# Altium project eRTM15_Baikal.PrjPCB (part 2 of 4)

## Sheet Reference_distribution.SchDoc: =ProjectName
size 420 x 297 mm; Author: SBH; CompanyName: WUT; DrawnBy: SBH; Organization: ISE-WUT; Address1: Warsaw Univeristy of Technology; Address2: Nowowiejska 15/19; DocumentNumber: 8; Revision: -; SheetNumber: 8; SheetTotal: 12; EDA_Number: ARTIQ; Projet: eRTM15 Baikal; ModifiedBy: -; CreateDate: XX/XX/XXXX; CheckedDate: -; Title2: Reference_distribution.SchDoc; DivGrp: ISE; Designer: SBH; ModifiedDate: -; ProjectName: eRTM15 Baikal
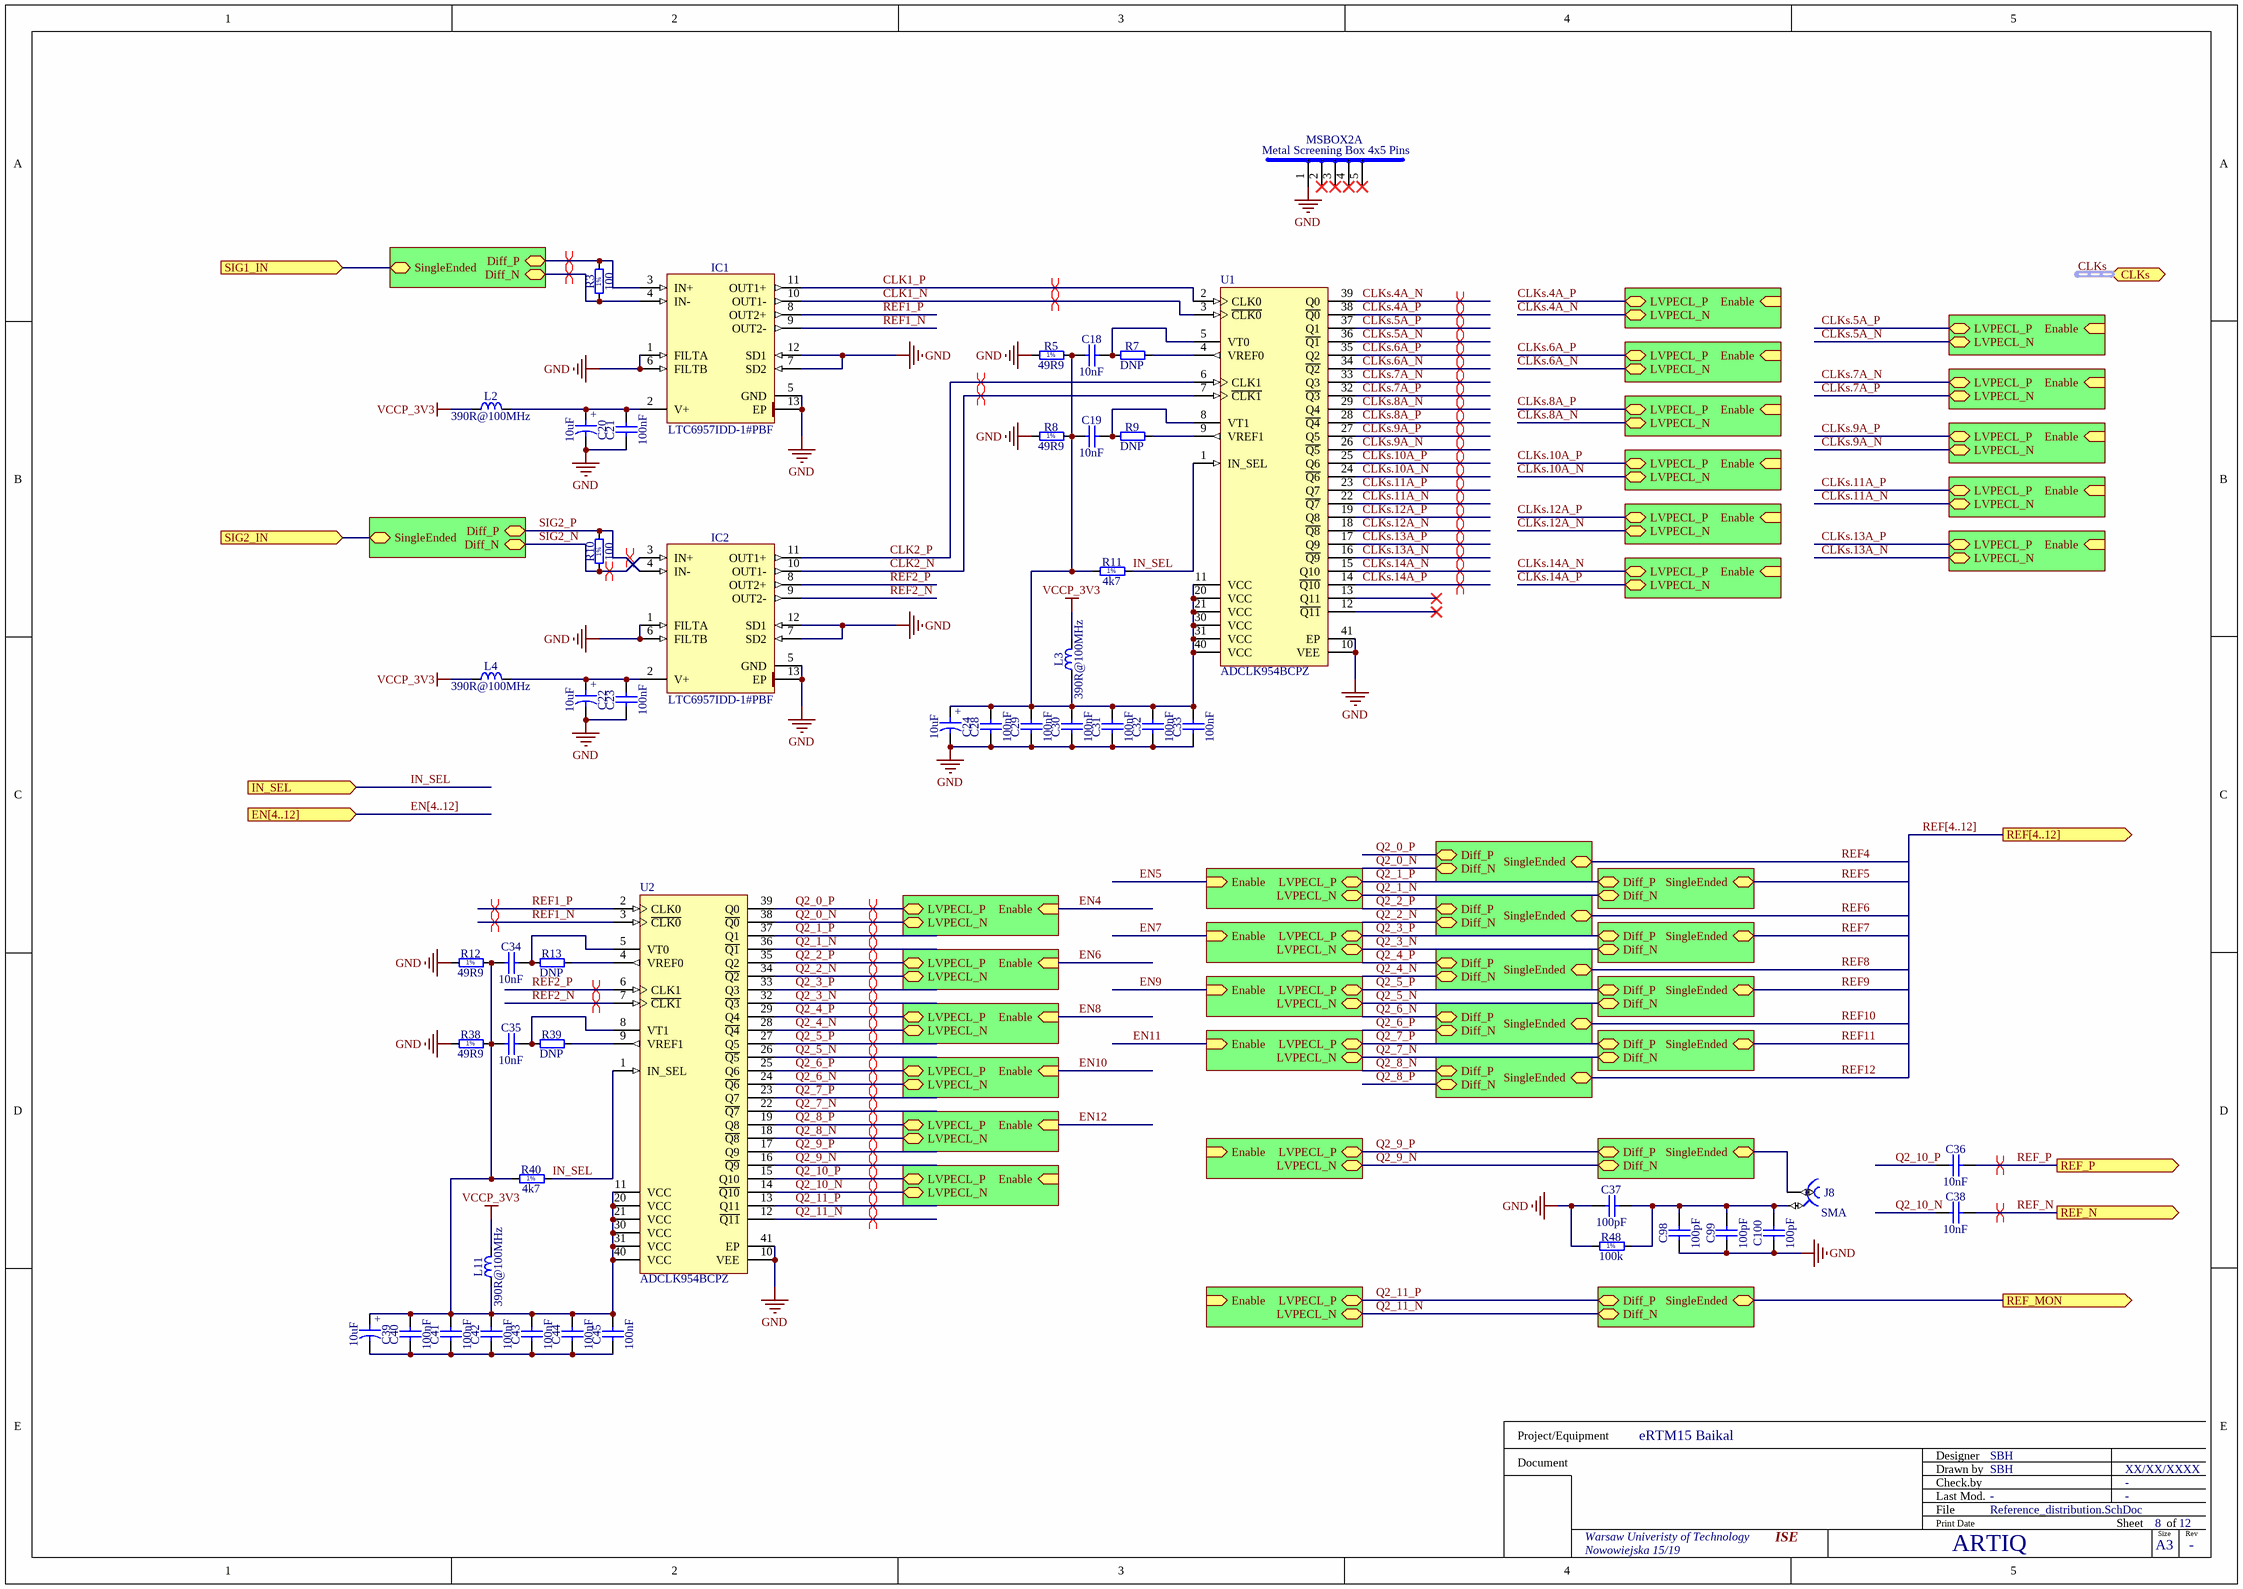
[diagram p5: Reference_distribution.SchDoc]

### Parts
C18  10nF  [CAPC1005X55N]
C19  10nF  [CAPC1005X55N]
C20  10uF  [CAPMP3216X180N]
C21  100nF  [CAPC1005X55N]
C22  10uF  [CAPMP3216X180N]
C23  100nF  [CAPC1005X55N]
C24  10uF  [CAPMP3216X180N]
C28  100nF  [CAPC1005X55N]
C29  100nF  [CAPC1005X55N]
C30  100nF  [CAPC1005X55N]
C31  100nF  [CAPC1005X55N]
C32  100nF  [CAPC1005X55N]
C33  100nF  [CAPC1005X55N]
C34  10nF  [CAPC1005X55N]
C35  10nF  [CAPC1005X55N]
C36  10nF  [CAPC1005X55N]
C37  100pF  [CAPC1005X55N]
C38  10nF  [CAPC1005X55N]
C39  10uF  [CAPMP3216X180N]
C40  100nF  [CAPC1005X55N]
C41  100nF  [CAPC1005X55N]
C42  100nF  [CAPC1005X55N]
C43  100nF  [CAPC1005X55N]
C44  100nF  [CAPC1005X55N]
C45  100nF  [CAPC1005X55N]
C98  100pF  [CAPC1005X55N]
C99  100pF  [CAPC1005X55N]
C100  100pF  [CAPC1005X55N]
IC1  LTC6957IDD-1#PBF  [SON45P300X300X80-13N-R175X248]
IC2  LTC6957IDD-1#PBF  [SON45P300X300X80-13N-R175X248]
J8  SMA  [HUBER-SUHNER_82_SMA-50-0-41/133_NE]
L2  390R@100MHz  [INDC1608X95N]
L3  390R@100MHz  [INDC1608X95N]
L4  390R@100MHz  [INDC1608X95N]
L11  390R@100MHz  [INDC1608X95N]
MSBOX2  Metal Screening Box 4x5 Pins  [MSBOX_WURTH_36103305]  (part A of 4)
R3  100  [RESC1005X40N]
R5  49R9  [RESC1005X40N]
R7  DNP  [RESC1005X40N]
R8  49R9  [RESC1005X40N]
R9  DNP  [RESC1005X40N]
R10  100  [RESC1005X40N]
R11  4k7  [RESC1005X40N]
R12  49R9  [RESC1005X40N]
R13  DNP  [RESC1005X40N]
R38  49R9  [RESC1005X40N]
R39  DNP  [RESC1005X40N]
R40  4k7  [RESC1005X40N]
R48  100k  [RESC1005X40N]
U1  ADCLK954BCPZ  [ADI-CP-40-8_M]
U2  ADCLK954BCPZ  [ADI-CP-40-8_M]

### Sub-sheets
U_Diff2SE = Diff2SE.SchDoc: Diff_P, Diff_N, SingleEnded
U_Diff2SE = Diff2SE.SchDoc: Diff_P, Diff_N, SingleEnded
U_Diff2SE = Diff2SE.SchDoc: Diff_P, Diff_N, SingleEnded
U_Diff2SE = Diff2SE.SchDoc: Diff_P, Diff_N, SingleEnded
U_Diff2SE = Diff2SE.SchDoc: Diff_P, Diff_N, SingleEnded
U_Diff2SE = Diff2SE.SchDoc: Diff_P, Diff_N, SingleEnded
U_Diff2SE = Diff2SE.SchDoc: Diff_P, Diff_N, SingleEnded
U_Diff2SE = Diff2SE.SchDoc: Diff_P, Diff_N, SingleEnded
U_Diff2SE = Diff2SE.SchDoc: Diff_P, Diff_N, SingleEnded
U_Diff2SE = Diff2SE.SchDoc: Diff_P, Diff_N, SingleEnded
U_Diff2SE = Diff2SE.SchDoc: Diff_P, Diff_N, SingleEnded
U_Diff2SE = Diff2SE.SchDoc: Diff_P, Diff_N, SingleEnded
U_Diff2SE = Diff2SE.SchDoc: Diff_P, Diff_N, SingleEnded
U_LvpeclTermWithCtrl = LvpeclTermWithCtrl.SchDoc: LVPECL_P (bidir), LVPECL_N (bidir), Enable (in)
U_LvpeclTermWithCtrl = LvpeclTermWithCtrl.SchDoc: LVPECL_P (bidir), LVPECL_N (bidir), Enable (in)
U_LvpeclTermWithCtrl = LvpeclTermWithCtrl.SchDoc: LVPECL_P (bidir), LVPECL_N (bidir), Enable (in)
U_LvpeclTermWithCtrl = LvpeclTermWithCtrl.SchDoc: LVPECL_P (bidir), LVPECL_N (bidir), Enable (in)
U_LvpeclTermWithCtrl = LvpeclTermWithCtrl.SchDoc: LVPECL_P (bidir), LVPECL_N (bidir), Enable (in)
U_LvpeclTermWithCtrl = LvpeclTermWithCtrl.SchDoc: LVPECL_P (bidir), LVPECL_N (bidir), Enable (in)
U_LvpeclTermWithCtrl = LvpeclTermWithCtrl.SchDoc: LVPECL_P (bidir), LVPECL_N (bidir), Enable (in)
U_LvpeclTermWithCtrl = LvpeclTermWithCtrl.SchDoc: LVPECL_P (bidir), LVPECL_N (bidir), Enable (in)
U_LvpeclTermWithCtrl = LvpeclTermWithCtrl.SchDoc: LVPECL_P (bidir), LVPECL_N (bidir), Enable (in)
U_LvpeclTermWithCtrl = LvpeclTermWithCtrl.SchDoc: LVPECL_P (bidir), LVPECL_N (bidir), Enable (in)
U_LvpeclTermWithCtrl = LvpeclTermWithCtrl.SchDoc: LVPECL_P (bidir), LVPECL_N (bidir), Enable (in)
U_LvpeclTermWithCtrl = LvpeclTermWithCtrl.SchDoc: LVPECL_P (bidir), LVPECL_N (bidir), Enable (in)
U_LvpeclTermWithCtrl = LvpeclTermWithCtrl.SchDoc: LVPECL_P (bidir), LVPECL_N (bidir), Enable (in)
U_LvpeclTermWithCtrl = LvpeclTermWithCtrl.SchDoc: LVPECL_P (bidir), LVPECL_N (bidir), Enable (in)
U_LvpeclTermWithCtrl = LvpeclTermWithCtrl.SchDoc: LVPECL_P (bidir), LVPECL_N (bidir), Enable (in)
U_LvpeclTermWithCtrl = LvpeclTermWithCtrl.SchDoc: LVPECL_P (bidir), LVPECL_N (bidir), Enable (in)
U_LvpeclTermWithCtrl = LvpeclTermWithCtrl.SchDoc: LVPECL_P (bidir), LVPECL_N (bidir), Enable (in)
U_LvpeclTermWithCtrl = LvpeclTermWithCtrl.SchDoc: LVPECL_P (bidir), LVPECL_N (bidir), Enable (in)
U_LvpeclTermWithCtrl = LvpeclTermWithCtrl.SchDoc: LVPECL_P (bidir), LVPECL_N (bidir), Enable (in)
U_LvpeclTermWithCtrl = LvpeclTermWithCtrl.SchDoc: LVPECL_P (bidir), LVPECL_N (bidir), Enable (in)
U_LvpeclTermWithCtrl = LvpeclTermWithCtrl.SchDoc: LVPECL_P (bidir), LVPECL_N (bidir), Enable (in)
U_LvpeclTermWithCtrl = LvpeclTermWithCtrl.SchDoc: LVPECL_P (bidir), LVPECL_N (bidir), Enable (in)
U_LvpeclTermWithCtrl = LvpeclTermWithCtrl.SchDoc: LVPECL_P (bidir), LVPECL_N (bidir), Enable (in)

### Ports
CLKs (harness CLKs), EN[4..12] (in), IN_SEL (in), REF[4..12] (out), REF_MON (out), REF_N (out), REF_P (out), SIG1_IN (in), SIG2_IN (in)

### Nets
GND: C20.2 C21.1 C22.2 C23.1 C24.2 C28.1 C29.1 C30.1 C31.1 C32.1 C33.1 C37.2 C98.2 C99.2 C100.2 IC1.1(FILTA) IC1.5(GND) IC1.6(FILTB) IC1.7(SD2) IC1.12(SD1) IC1.13(EP) IC2.1(FILTA) IC2.5(GND) IC2.6(FILTB) IC2.7(SD2) IC2.12(SD1) IC2.13(EP) MSBOX2.1 R5.1 R8.1 R12.1 R38.1 R48.1 U1.10(VEE) U1.41(EP) U2.10(VEE) U2.41(EP)
VCCP_3V3: L2.1 L3.2 L4.1 L11.2
CLK1_N: IC1.10(OUT1-) U1.3(~{CLK0})
CLK1_P: IC1.11(OUT1+) U1.2(CLK0)
CLK2_N: IC2.10(OUT1-) U1.7(~{CLK1})
CLK2_P: IC2.11(OUT1+) U1.6(CLK1)
CLKs.4A_N: U1.39(Q0) ; sheet U_LvpeclTermWithCtrl/LVPECL_N
CLKs.4A_P: U1.38(~{Q0}) ; sheet U_LvpeclTermWithCtrl/LVPECL_P
CLKs.5A_N: U1.36(~{Q1}) ; sheet U_LvpeclTermWithCtrl/LVPECL_N
CLKs.5A_P: U1.37(Q1) ; sheet U_LvpeclTermWithCtrl/LVPECL_P
CLKs.6A_N: U1.34(~{Q2}) ; sheet U_LvpeclTermWithCtrl/LVPECL_N
CLKs.6A_P: U1.35(Q2) ; sheet U_LvpeclTermWithCtrl/LVPECL_P
CLKs.7A_N: U1.33(Q3) ; sheet U_LvpeclTermWithCtrl/LVPECL_P
CLKs.7A_P: U1.32(~{Q3}) ; sheet U_LvpeclTermWithCtrl/LVPECL_N
CLKs.8A_N: U1.29(Q4) ; sheet U_LvpeclTermWithCtrl/LVPECL_N
CLKs.8A_P: U1.28(~{Q4}) ; sheet U_LvpeclTermWithCtrl/LVPECL_P
CLKs.9A_N: U1.26(~{Q5}) ; sheet U_LvpeclTermWithCtrl/LVPECL_N
CLKs.9A_P: U1.27(Q5) ; sheet U_LvpeclTermWithCtrl/LVPECL_P
CLKs.10A_N: U1.24(~{Q6}) ; sheet U_LvpeclTermWithCtrl/LVPECL_N
CLKs.10A_P: U1.25(Q6) ; sheet U_LvpeclTermWithCtrl/LVPECL_P
CLKs.11A_N: U1.22(~{Q7}) ; sheet U_LvpeclTermWithCtrl/LVPECL_N
CLKs.11A_P: U1.23(Q7) ; sheet U_LvpeclTermWithCtrl/LVPECL_P
CLKs.12A_N: U1.18(~{Q8}) ; sheet U_LvpeclTermWithCtrl/LVPECL_N
CLKs.12A_P: U1.19(Q8) ; sheet U_LvpeclTermWithCtrl/LVPECL_P
CLKs.13A_N: U1.16(~{Q9}) ; sheet U_LvpeclTermWithCtrl/LVPECL_N
CLKs.13A_P: U1.17(Q9) ; sheet U_LvpeclTermWithCtrl/LVPECL_P
CLKs.14A_N: U1.15(Q10) ; sheet U_LvpeclTermWithCtrl/LVPECL_P
CLKs.14A_P: U1.14(~{Q10}) ; sheet U_LvpeclTermWithCtrl/LVPECL_N
Diff_N: IC1.4(IN-) R3.1 ; sheet U_Diff2SE/Diff_N
Diff_P: IC1.3(IN+) R3.2 ; sheet U_Diff2SE/Diff_P
IN_SEL: R11.2 R40.2 U1.1(IN_SEL) U2.1(IN_SEL) ; port IN_SEL
Osc_out: port SIG2_IN, sheet U_Diff2SE/SingleEnded
Q2_0_N: U2.38(~{Q0}) ; sheet U_Diff2SE/Diff_N, sheet U_LvpeclTermWithCtrl/LVPECL_N
Q2_0_P: U2.39(Q0) ; sheet U_Diff2SE/Diff_P, sheet U_LvpeclTermWithCtrl/LVPECL_P
Q2_1_N: U2.36(~{Q1}) ; sheet U_Diff2SE/Diff_N, sheet U_LvpeclTermWithCtrl/LVPECL_N
Q2_1_P: U2.37(Q1) ; sheet U_Diff2SE/Diff_P, sheet U_LvpeclTermWithCtrl/LVPECL_P
Q2_2_N: U2.34(~{Q2}) ; sheet U_Diff2SE/Diff_N, sheet U_LvpeclTermWithCtrl/LVPECL_N
Q2_2_P: U2.35(Q2) ; sheet U_Diff2SE/Diff_P, sheet U_LvpeclTermWithCtrl/LVPECL_P
Q2_3_N: U2.32(~{Q3}) ; sheet U_Diff2SE/Diff_N, sheet U_LvpeclTermWithCtrl/LVPECL_N
Q2_3_P: U2.33(Q3) ; sheet U_Diff2SE/Diff_P, sheet U_LvpeclTermWithCtrl/LVPECL_P
Q2_4_N: U2.28(~{Q4}) ; sheet U_Diff2SE/Diff_N, sheet U_LvpeclTermWithCtrl/LVPECL_N
Q2_4_P: U2.29(Q4) ; sheet U_Diff2SE/Diff_P, sheet U_LvpeclTermWithCtrl/LVPECL_P
Q2_5_N: U2.26(~{Q5}) ; sheet U_Diff2SE/Diff_N, sheet U_LvpeclTermWithCtrl/LVPECL_N
Q2_5_P: U2.27(Q5) ; sheet U_Diff2SE/Diff_P, sheet U_LvpeclTermWithCtrl/LVPECL_P
Q2_6_N: U2.24(~{Q6}) ; sheet U_Diff2SE/Diff_P, sheet U_LvpeclTermWithCtrl/LVPECL_N
Q2_6_P: U2.25(Q6) ; sheet U_Diff2SE/Diff_N, sheet U_LvpeclTermWithCtrl/LVPECL_P
Q2_7_N: U2.22(~{Q7}) ; sheet U_Diff2SE/Diff_N, sheet U_LvpeclTermWithCtrl/LVPECL_N
Q2_7_P: U2.23(Q7) ; sheet U_Diff2SE/Diff_P, sheet U_LvpeclTermWithCtrl/LVPECL_P
Q2_8_N: U2.18(~{Q8}) ; sheet U_Diff2SE/Diff_P, sheet U_LvpeclTermWithCtrl/LVPECL_N
Q2_8_P: U2.19(Q8) ; sheet U_Diff2SE/Diff_N, sheet U_LvpeclTermWithCtrl/LVPECL_P
Q2_9_N: U2.16(~{Q9}) ; sheet U_Diff2SE/Diff_N, sheet U_LvpeclTermWithCtrl/LVPECL_N
Q2_9_P: U2.17(Q9) ; sheet U_Diff2SE/Diff_P, sheet U_LvpeclTermWithCtrl/LVPECL_P
Q2_10_N: C38.1 U2.14(~{Q10}) ; sheet U_LvpeclTermWithCtrl/LVPECL_N
Q2_10_P: C36.1 U2.15(Q10) ; sheet U_LvpeclTermWithCtrl/LVPECL_P
Q2_11_N: U2.12(~{Q11}) ; sheet U_Diff2SE/Diff_N, sheet U_LvpeclTermWithCtrl/LVPECL_N
Q2_11_P: U2.13(Q11) ; sheet U_Diff2SE/Diff_P, sheet U_LvpeclTermWithCtrl/LVPECL_P
REF1_N: IC1.9(OUT2-) U2.3(~{CLK0})
REF1_P: IC1.8(OUT2+) U2.2(CLK0)
REF2_N: IC2.9(OUT2-) U2.7(~{CLK1})
REF2_P: IC2.8(OUT2+) U2.6(CLK1)
REF_IN: port SIG1_IN, sheet U_Diff2SE/SingleEnded
REF_N: C38.2 ; port REF_N  [project net REF_CLK_IN_N]
REF_OUT: port REF_MON, sheet U_Diff2SE/SingleEnded
REF_P: C36.2 ; port REF_P  [project net REF_CLK_IN_P]
SIG2_N: IC2.3(IN+) R10.1 ; sheet U_Diff2SE/Diff_N
SIG2_P: IC2.4(IN-) R10.2 ; sheet U_Diff2SE/Diff_P
SingleEnded: J8.1 ; sheet U_Diff2SE/SingleEnded
NetC18_1: C18.1 C19.1 C24.1 C28.2 C29.2 C30.2 C31.2 C32.2 C33.2 L3.1 R5.2 R8.2 R11.1 U1.11(VCC) U1.20(VCC) U1.21(VCC) U1.30(VCC) U1.31(VCC) U1.40(VCC)
NetC18_2: C18.2 R7.1 U1.5(VT0)
NetC19_2: C19.2 R9.1 U1.8(VT1)
NetC20_1: C20.1 C21.2 IC1.2(V+) L2.2
NetC22_1: C22.1 C23.2 IC2.2(V+) L4.2
NetC34_1: C34.1 C35.1 C39.1 C40.2 C41.2 C42.2 C43.2 C44.2 C45.2 L11.1 R12.2 R38.2 R40.1 U2.11(VCC) U2.20(VCC) U2.21(VCC) U2.30(VCC) U2.31(VCC) U2.40(VCC)
NetC34_2: C34.2 R13.1 U2.5(VT0)
NetC35_2: C35.2 R39.1 U2.8(VT1)
NetC37_1: C37.1 C98.1 C99.1 C100.1 J8.2 R48.2
NetC39_2: C39.2 C40.1 C41.1 C42.1 C43.1 C44.1 C45.1
NetR7_2: R7.2 U1.4(VREF0)
NetR9_2: R9.2 U1.9(VREF1)
NetR13_2: R13.2 U2.4(VREF0)
NetR39_2: R39.2 U2.9(VREF1)

Not connected (* = marked no-connect by the designer): MSBOX2 2* 3* 4* 5*; U1 12(~{Q11})* 13(Q11)*

### Buses and harness runs
bus EN[4..12] = port EN[4..12]
bus REF[4..12] = port REF[4..12]
harness CLKs = port CLKs

### Layout directives
differential pair: CLK1_N, CLK1_P, CLK2_N, CLK2_P, CLKs.4A_N, CLKs.4A_P, CLKs.5A_N, CLKs.5A_P, CLKs.6A_N, CLKs.6A_P, CLKs.7A_N, CLKs.7A_P, CLKs.8A_N, CLKs.8A_P, CLKs.9A_N, CLKs.9A_P, CLKs.10A_N, CLKs.10A_P, CLKs.11A_N, CLKs.11A_P, CLKs.12A_N, CLKs.12A_P, CLKs.13A_N, CLKs.13A_P, CLKs.14A_N, CLKs.14A_P, Diff_N, Diff_P, Q2_0_N, Q2_0_P, Q2_1_N, Q2_1_P, Q2_2_N, Q2_2_P, Q2_3_N, Q2_3_P, Q2_4_N, Q2_4_P, Q2_5_N, Q2_5_P, Q2_6_N, Q2_6_P, Q2_7_N, Q2_7_P, Q2_8_N, Q2_8_P, Q2_9_N, Q2_9_P, Q2_10_N, Q2_10_P, Q2_11_N, Q2_11_P, REF1_N, REF1_P, REF2_N, REF2_P, REF_CLK_IN_N, REF_CLK_IN_P, SIG2_N, SIG2_P

### Notes on the sheet
- Project/Equipment
- Document
- Designer
- Drawn by
- Check.by
- File
- Last Mod.
- Print Date
- Sheet
- Size
- A3
- of
- Rev
- (in symbol CTE3216-18_10UF_10V_10%_LESR1800) +
- (in symbol R0402_4K7_1%_0.0625W_100PPM) 1%
- (in symbol R0402_49R9_1%_0.0625W_100PPM) 1%
- (in symbol R0402_100R_1%_0.0625W_100PPM) 1%

### Library data of the parts
C18 C19 C34-C36 C38 = CC0402_10NF_16V_10%_X7R: Non-polarised capacitor; Part Description: SMD Multilayer Chip Ceramic Capacitor; Manufacturer: GENERIC; Manufacturer1 Part Number: 223878715636; Voltage: 16V; TC: X7R; Tolerance: ±10%; Part Number: CC0402_10NF_16V_10%_X7R; Component Kind: Standard; Component Type: Standard; Pin Count: 2; Value: 10nF; Status: Not Recommended; Manufacturer Part Number: CC0402_10NF_16V_10%_X7R; Case: 0402; Mounted: Yes; Socket: No; SMD: Yes; Sense: No; Manufacturer1 Example: PHYCOMP; Manufacturer1 ComponentHeight: 0.55mm; HelpURL: \\cern.ch\dfs\Applications\Altium\Datasheets\CC0402_X7R_PHYCOMP.pdf; Author: CERN DEM JLC; CreateDate: 2007-12-03; LatestRevisionDate: 2007-12-03
C20 C22 C24 C39 = CTE3216-18_10UF_10V_10%_LESR1800: Polarised capacitor; Part Description: Low ESR 1R8 Solid Tantalum Chip Capacitor; Manufacturer: GENERIC; Manufacturer1 Part Number: TPSA106K010R1800; Voltage: 10V; Tolerance: ±10%; Part Number: CTE3216-18_10UF_10V_10%_LESR1800; Component Kind: Standard; Component Type: Standard; Pin Count: 2; Value: 10uF; Status: Preferred; Manufacturer Part Number: CTE3216-18_10UF_10V_10%_LESR1800; Case: A; Mounted: Yes; Socket: No; SMD: Yes; Sense: No; Manufacturer1 Example: AVX; Manufacturer1 ComponentHeight: 1.8mm; HelpURL: \\cern.ch\dfs\Applications\Altium\Datasheets\CTE-LESR_AVX_TPS.pdf; Author: CERN DEM JLC; CreateDate: 2008-05-05; LatestRevisionDate: 2009-01-20
C21 C23 C28-C33 C40-C45 = CC0402_100NF_16V_10%_X7R: Non-polarised capacitor; Part Description: SMD Multilayer Chip Ceramic Capacitor; Manufacturer: GENERIC; Manufacturer1 Part Number: GRM155R71C104KA88D; Voltage: 16V; TC: X7R; Tolerance: ±10%; Part Number: CC0402_100NF_16V_10%_X7R; Component Kind: Standard; Component Type: Standard; Pin Count: 2; Value: 100nF; Status: Not Recommended; Manufacturer Part Number: CC0402_100NF_16V_10%_X7R; Case: 0402; Mounted: Yes; Socket: No; SMD: Yes; Sense: No; Manufacturer1 Example: MURATA; Manufacturer1 ComponentHeight: 0.55mm; HelpURL: \\cern.ch\dfs\Applications\Altium\Datasheets\CC0402_X7R_MURATA_GRM.pdf; Author: CERN DEM JLC; CreateDate: 2013-12-05; LatestRevisionDate: 2007-12-03
C37 C98-C100 = CC0402_100PF_50V_5%_C0G: Non-polarised capacitor; Part Description: SMD Multilayer Chip Ceramic Capacitor; Manufacturer: GENERIC; Manufacturer1 Part Number: C0402C101J5GACTU; Voltage: 50V; TC: C0G/NP0; Tolerance: ±5%; Part Number: CC0402_100PF_50V_5%_C0G; Component Kind: Standard; Component Type: Standard; Pin Count: 2; Value: 100pF; Status: Preferred; Manufacturer Part Number: CC0402_100PF_50V_5%_C0G; Case: 0402; Mounted: Yes; Socket: No; SMD: Yes; Sense: No; Manufacturer1 Example: KEMET; Manufacturer1 ComponentHeight: 0.55mm; HelpURL: \\cern.ch\dfs\Applications\Altium\Datasheets\CC0805_C0G_KEMET_(Commercial Grade).pdf; Author: CERN DEM JLC; CreateDate: 2007-12-03; LatestRevisionDate: 2015-04-22
IC1 IC2 = LTC6957IDD-1#PBF: Low Phase Noise, Dual Output Buffer/Driver/Logic Converter, LVPECL Logic Outputs; Manufacturer: LINEAR TECHNOLOGY; PressFit: No; Bonding: No; Part Number: LTC6957IDD-1#PBF; Component Kind: Standard; Component Type: Standard; Device: LTC6957IDD-1#PBF; PackageDescription: SON, 0.45mm Pitch; 12 Pin, 3.00mm W X 3.00mm L X 0.80mm H Body (w/Thermal tab 1.75 x 2.48mm), IPC Medium Density; Part Description: Low Phase Noise, Dual Output Buffer/Driver/Logic Converter, LVPECL Logic Outputs; Manufacturer Part Number: LTC6957IDD-1#PBF; Pin Count: 13; Case: SON12; Mounted: Yes; Socket: No; SMD: Yes; Sense: No; ComponentHeight: 0.8mm; Author: CERN DEM JLC; HelpURL: \\cern.ch\dfs\Applications\Altium\Datasheets\LTC6957IDD-1#PBF.pdf; CreateDate: 2016-12-07; LatestRevisionDate: 2016-12-07
J8 = HUBER-SUHNER_82_SMA-50-0-41/133_NE: Part Description: SMA 50 Ohms Straight PCB Jack; Manufacturer: HUBER+SUHNER; PressFit: No; Part Number: HUBER-SUHNER_82_SMA-50-0-41/133_NE; Component Kind: Standard; Component Type: Standard; Pin Count: 2; Family: SMA; Mounted: Yes; Socket: No; SMD: No; Sense: No; Status: None; Manufacturer Part Number: 82_SMA-50-0-41/133_NE; ComponentHeight: 9.6mm; HelpURL: \\cern.ch\dfs\Applications\Altium\Datasheets\HUBER-SUHNER_82_SMA-50-0-41-133_NE.pdf; Author: CERN DEM JLC; CreateDate: 2010-04-20; LatestRevisionDate: 2014-11-06
L2-L4 L11 = IND0603_TDK_MPZ1608R391A: as L6 on sheet PowerSupply; Part Number: IND0603_TDK_MPZ1608R391A; Component Kind: Standard; Component Type: Standard; Pin Count: 2; Value: 390R@100MHz; Status: None; Manufacturer Part Number: MPZ1608R391A; Case: 0603; Mounted: Yes; Socket: No; SMD: Yes; Sense: No; ComponentHeight: 0.95mm; HelpURL: \\cern.ch\dfs\Applications\Altium\Datasheets\IND0603_TDK_MPZ1608.pdf; Author: CERN DEM JLC; CreateDate: 2009-12-02; LatestRevisionDate: 2009-12-02
MSBOX2 = MSBOX_WURTH_36103305: Metal Screening Box 20 (4x5) Pins; Part Description: Shielding Cabinet SMD-Frame WE-SHC, Internal Dimensions 30 x 30mm; Manufacturer: WURTH; PressFit: No; Part Number: MSBOX_WURTH_36103305; Component Kind: Standard; Component Type: Standard; Pin Count: 20; PackageDescription: Shielding Cabinet SMD-Frame WE-SHC, Internal Dimensions 30 x 30mm; Mounted: Yes; Socket: No; SMD: Yes; Sense: No; Status: None; Manufacturer Part Number: 36103305; ComponentHeight: 3.1mm; HelpURL: \\cern.ch\dfs\Applications\Altium\Datasheets\MSBOX_WURTH_36103305.pdf; Author: CERN DEM JLC; CreateDate: 2012-07-02; LatestRevisionDate: 2012-07-02
R3 R10 = R0402_100R_1%_0.0625W_100PPM: Resistor - 1%; Part Description: General Purpose Thick Film Chip Resistor; Manufacturer: GENERIC; Manufacturer1 Part Number: 232270671001L; TC: ±100ppm/°C; Part Number: R0402_100R_1%_0.0625W_100PPM; Component Kind: Standard; Component Type: Standard; Pin Count: 2; Value: 100; Status: Not recommended; Power: 0.0625W; Tolerance: ±1%; Manufacturer Part Number: R0402_100R_1%_0.0625W_100PPM; Case: 0402; Mounted: Yes; Sense: No; Socket: No; SMD: Yes; Manufacturer1 Example: YAGEO PHYCOMP; Manufacturer1 ComponentHeight: 0.4mm; HelpURL: \\cern.ch\dfs\Applications\Altium\Datasheets\R0402_Phycomp_RC0402.pdf; Author: CERN DEM JLC; CreateDate: 2007-12-03; LatestRevisionDate: 2012-10-17
R5 R8 R12 R38 = R0402_49R9_1%_0.0625W_100PPM: Resistor - 1%; Part Description: General Purpose Thick Film Chip Resistor; Manufacturer: GENERIC; Manufacturer1 Part Number: 232270674999L or RC0402FR-0749R9L; TC: ±100ppm/°C; Part Number: R0402_49R9_1%_0.0625W_100PPM; Component Kind: Standard; Component Type: Standard; Pin Count: 2; Value: 49R9; Status: Not recommended; Power: 0.0625W; Tolerance: ±1%; Manufacturer Part Number: R0402_49R9_1%_0.0625W_100PPM; Case: 0402; Mounted: Yes; Sense: No; Socket: No; SMD: Yes; Manufacturer1 Example: YAGEO PHYCOMP; Manufacturer1 ComponentHeight: 0.4mm; HelpURL: \\cern.ch\dfs\Applications\Altium\Datasheets\R0402_Phycomp_RC0402.pdf; Author: CERN DEM JLC; CreateDate: 2012-10-24; LatestRevisionDate: 2012-10-24
R7 R9 R13 R39 = R0402_0R_JUMPER: Resistor; Part Description: 1A (0.05R Max DC Resistance) Zero Ohm Jumper; Manufacturer: GENERIC; Manufacturer1 Part Number: 232270591001L; Value: 0; Mounted: DNP; Part Number: R0402_0R_JUMPER; Component Kind: Standard; Component Type: Standard; Pin Count: 2; Status: Not recommended; Manufacturer Part Number: R0402_0R_JUMPER; Case: 0402; Sense: No; Socket: No; SMD: Yes; Manufacturer1 Example: YAGEO PHYCOMP; Manufacturer1 ComponentHeight: 0.4mm; HelpURL: \\cern.ch\dfs\Applications\Altium\Datasheets\R0402_Phycomp_RC0402.pdf; Author: CERN DEM JLC; CreateDate: 2007-12-03; LatestRevisionDate: 2012-10-17
R11 R40 = R0402_4K7_1%_0.0625W_100PPM: Resistor - 1%; Part Description: General Purpose Thick Film Chip Resistor; Manufacturer: GENERIC; Manufacturer1 Part Number: 232270674702L; TC: ±100ppm/°C; Part Number: R0402_4K7_1%_0.0625W_100PPM; Component Kind: Standard; Component Type: Standard; Pin Count: 2; Value: 4k7; Status: Not recommended; Power: 0.0625W; Tolerance: ±1%; Manufacturer Part Number: R0402_4K7_1%_0.0625W_100PPM; Case: 0402; Mounted: Yes; Sense: No; Socket: No; SMD: Yes; Manufacturer1 Example: YAGEO PHYCOMP; Manufacturer1 ComponentHeight: 0.4mm; HelpURL: \\cern.ch\dfs\Applications\Altium\Datasheets\R0402_Phycomp_RC0402.pdf; Author: CERN DEM JLC; CreateDate: 2007-12-03; LatestRevisionDate: 2012-10-17
R48 = R0402_4K7_1%_0.0625W_100PPM: as R41 on sheet FP_connectors; Component Kind: Standard; Component Type: Standard; Pin Count: 2; Value: 100k; Status: Not recommended; Power: 0.0625W; Tolerance: ±1%; Manufacturer Part Number: R0402_4K7_1%_0.0625W_100PPM; Case: 0402; Mounted: Yes; Sense: No; Socket: No; SMD: Yes; Manufacturer1 Example: YAGEO PHYCOMP; Manufacturer1 ComponentHeight: 0.4mm; HelpURL: \\cern.ch\dfs\Applications\Altium\Datasheets\R0402_Phycomp_RC0402.pdf; Author: CERN DEM JLC; CreateDate: 2007-12-03; LatestRevisionDate: 2012-10-17
U1 U2 = CMP-0884-00036-1: 2 Selectable Inputs, 12 LVPECL Outputs, SiGe Clock Fanout Buffer, 3.3 V Supply, Industrial, 40-pin QFN (CP-40-8), Tray; Manufacturer: Analog Devices; Supply Voltage (V): 3.3; # of Outputs: 12; On-Chip VCO or DCO: No; Max f-out: 4.8 GHz; # of Inputs: 2; I/O Interface: Pin Select; PackageVersion: 082708-A, 08/2008; DatasheetVersion: Rev. B; Output Logic: LVPECL; PackageReference: CP-40-8; Mounting Technology: Surface Mount; ComponentLink1Description: Manufacturer URL; ComponentLink2Description: Datasheet; ComponentLink4URL: http://www.analog.com/en/clock-and-timing/clock-generation-and-distribution/adclk954/products/product.html; Code_JEDEC: MO-220-VJJD-2; ComponentLink2URL: http://www.analog.com/static/imported-files/data_sheets/ADCLK954.pdf; ComponentLink1URL: http://www.analog.com/en/index.html; ComponentLink4Description: Product URL; PartNumber: ADCLK954BCPZ; ComponentLink3URL: http:/www.analog.com/static/imported-files/packages/PKG_PDF/LFCSP(CP)/CP_40_8.pdf; PackageDescription: 40-Pin Lead Frame Chip Scale Package, Body 6 x 6 mm, Pitch 0.5 mm; Packing: Tray; ComponentLink3Description: Package Specification

## Sheet Diff2SE.SchDoc: =ProjectName
size 420 x 297 mm; Author: SBH; CompanyName: WUT; DrawnBy: SBH; Organization: ISE-WUT; Address1: Warsaw Univeristy of Technology; Address2: Nowowiejska 15/19; DocumentNumber: 7; Revision: -; SheetNumber: 7; SheetTotal: 12; EDA_Number: ARTIQ; Projet: eRTM15 Baikal; ModifiedBy: -; CreateDate: XX/XX/XXXX; CheckedDate: -; Title2: Diff2SE.SchDoc; DivGrp: ISE; Designer: SBH; ModifiedDate: -; ProjectName: eRTM15 Baikal
Used 35 times, as channels U_Reference_distribution/U_Diff2SE, U_Reference_distribution/U_Diff2SE, U_Reference_distribution/U_Diff2SE, U_Reference_distribution/U_Diff2SE, U_Reference_distribution/U_Diff2SE, U_Reference_distribution/U_Diff2SE, U_Reference_distribution/U_Diff2SE, U_Reference_distribution/U_Diff2SE, U_Reference_distribution/U_Diff2SE, U_Reference_distribution/U_Diff2SE, U_Reference_distribution/U_Diff2SE, U_Reference_distribution/U_Diff2SE, U_Reference_distribution/U_Diff2SE, U_LO_distribution/U_Diff2SE, U_LO_distribution/U_Diff2SE, U_LO_distribution/U_Diff2SE, U_LO_distribution/U_Diff2SE, U_LO_distribution/U_Diff2SE, U_LO_distribution/U_Diff2SE, U_LO_distribution/U_Diff2SE, U_LO_distribution/U_Diff2SE, U_LO_distribution/U_Diff2SE, U_LO_distribution/U_Diff2SE, U_LO_distribution/U_Diff2SE, U_HF_CLK_Distribution/U_Diff2SE, U_HF_CLK_Distribution/U_Diff2SE, U_HF_CLK_Distribution/U_Diff2SE, U_HF_CLK_Distribution/U_Diff2SE, U_HF_CLK_Distribution/U_Diff2SE, U_HF_CLK_Distribution/U_Diff2SE, U_HF_CLK_Distribution/U_Diff2SE, U_HF_CLK_Distribution/U_Diff2SE, U_HF_CLK_Distribution/U_Diff2SE, U_HF_CLK_Distribution/U_Diff2SE, U_HF_CLK_Distribution/U_Diff2SE. Parts and nets are listed once, with the designators drawn on the sheet.
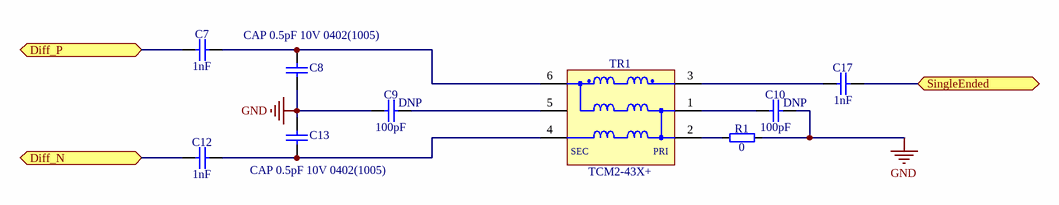
[diagram p6: Diff2SE.SchDoc]

### Parts
C7  1nF  [CAPC1005X55N]
C8  CAP 0.5pF 10V 0402(1005)  [CAPC0402(1005)60_M]
C9  100pF  Mounted: DNP  [CAPC1005X55N]
C10  100pF  Mounted: DNP  [CAPC1005X55N]
C12  1nF  [CAPC1005X55N]
C13  CAP 0.5pF 10V 0402(1005)  [CAPC0402(1005)60_M]
C17  1nF  [CAPC1005X55N]
R1  0  [RESC1005X40N]
TR1  TCM2-43X+  [XFMR_MINI-CIRCUITS_DB1627]

### Ports
Diff_N, Diff_P, SingleEnded

### Nets
GND: C8.1 C9.1 C10.2 C13.2 R1.2
Diff_N: C12.1 ; port Diff_N
Diff_P: C7.1 ; port Diff_P
SingleEnded: C17.2 ; port SingleEnded
NetC7_2: C7.2 C8.2 TR1.6(S1)
NetC9_2: C9.2 TR1.5(NC)
NetC10_1: C10.1 TR1.1(P1)
NetC12_2: C12.2 C13.1 TR1.4(S1)
NetC17_1: C17.1 TR1.3(P1)
NetR1_1: R1.1 TR1.2(P1)

### Channels
U_Reference_distribution/U_Diff2SE: designators end in _1; ports Diff_N=Q2_0_N Diff_P=Q2_0_P SingleEnded=REF4
U_Reference_distribution/U_Diff2SE: designators end in _2; ports Diff_N=Q2_1_N Diff_P=Q2_1_P SingleEnded=REF5
U_Reference_distribution/U_Diff2SE: designators end in _3; ports Diff_N=Q2_2_N Diff_P=Q2_2_P SingleEnded=REF6
U_Reference_distribution/U_Diff2SE: designators end in _4; ports Diff_N=Q2_3_N Diff_P=Q2_3_P SingleEnded=REF7
U_Reference_distribution/U_Diff2SE: designators end in _5; ports Diff_N=Q2_4_N Diff_P=Q2_4_P SingleEnded=REF8
U_Reference_distribution/U_Diff2SE: designators end in _6; ports Diff_N=Q2_5_N Diff_P=Q2_5_P SingleEnded=REF9
U_Reference_distribution/U_Diff2SE: designators end in _7; ports Diff_N=Q2_6_P Diff_P=Q2_6_N SingleEnded=REF10
U_Reference_distribution/U_Diff2SE: designators end in _8; ports Diff_N=Q2_7_N Diff_P=Q2_7_P SingleEnded=REF11
U_Reference_distribution/U_Diff2SE: designators end in _9; ports Diff_N=Q2_8_P Diff_P=Q2_8_N SingleEnded=REF12
U_Reference_distribution/U_Diff2SE: designators end in _10; ports Diff_N=Q2_9_N Diff_P=Q2_9_P SingleEnded=SingleEnded
U_Reference_distribution/U_Diff2SE: designators end in _11; ports Diff_N=Diff_N Diff_P=Diff_P SingleEnded=REF_IN
U_Reference_distribution/U_Diff2SE: designators end in _12; ports Diff_N=SIG2_N Diff_P=SIG2_P SingleEnded=Osc_out
U_Reference_distribution/U_Diff2SE: designators end in _13; ports Diff_N=Q2_11_N Diff_P=Q2_11_P SingleEnded=REF_OUT
U_LO_distribution/U_Diff2SE: designators end in _14; ports Diff_N=Q2_0_N_U_LO_distribution Diff_P=Q2_0_P_U_LO_distribution SingleEnded=LO4
U_LO_distribution/U_Diff2SE: designators end in _15; ports Diff_N=Q2_1_N_U_LO_distribution Diff_P=Q2_1_P_U_LO_distribution SingleEnded=LO5
U_LO_distribution/U_Diff2SE: designators end in _16; ports Diff_N=Q2_2_N_U_LO_distribution Diff_P=Q2_2_P_U_LO_distribution SingleEnded=LO6
U_LO_distribution/U_Diff2SE: designators end in _17; ports Diff_N=Q2_3_N_U_LO_distribution Diff_P=Q2_3_P_U_LO_distribution SingleEnded=LO7
U_LO_distribution/U_Diff2SE: designators end in _18; ports Diff_N=Q2_4_P_U_LO_distribution Diff_P=Q2_4_N_U_LO_distribution SingleEnded=LO8
U_LO_distribution/U_Diff2SE: designators end in _19; ports Diff_N=Q2_5_N_U_LO_distribution Diff_P=Q2_5_P_U_LO_distribution SingleEnded=LO9
U_LO_distribution/U_Diff2SE: designators end in _20; ports Diff_N=Q2_6_P_U_LO_distribution Diff_P=Q2_6_N_U_LO_distribution SingleEnded=LO10
U_LO_distribution/U_Diff2SE: designators end in _21; ports Diff_N=Q2_7_N_U_LO_distribution Diff_P=Q2_7_P_U_LO_distribution SingleEnded=LO11
U_LO_distribution/U_Diff2SE: designators end in _22; ports Diff_N=Q2_8_N_U_LO_distribution Diff_P=Q2_8_P_U_LO_distribution SingleEnded=LO12
U_LO_distribution/U_Diff2SE: designators end in _23; ports Diff_N=Diff_N Diff_P=Diff_P SingleEnded=LO_IN
U_LO_distribution/U_Diff2SE: designators end in _24; ports Diff_N=Q2_11_N_U_LO_distribution Diff_P=Q2_11_P_U_LO_distribution SingleEnded=LO_OUT
U_HF_CLK_Distribution/U_Diff2SE: designators end in _25; ports Diff_N=Q2_0_N_U_HF_CLK_Distribution Diff_P=Q2_0_P_U_HF_CLK_Distribution SingleEnded=HF_CLK4
U_HF_CLK_Distribution/U_Diff2SE: designators end in _26; ports Diff_N=Q2_1_N_U_HF_CLK_Distribution Diff_P=Q2_1_P_U_HF_CLK_Distribution SingleEnded=HF_CLK5
U_HF_CLK_Distribution/U_Diff2SE: designators end in _27; ports Diff_N=Q2_2_N_U_HF_CLK_Distribution Diff_P=Q2_2_P_U_HF_CLK_Distribution SingleEnded=HF_CLK6
U_HF_CLK_Distribution/U_Diff2SE: designators end in _28; ports Diff_N=Q2_3_N_U_HF_CLK_Distribution Diff_P=Q2_3_P_U_HF_CLK_Distribution SingleEnded=HF_CLK7
U_HF_CLK_Distribution/U_Diff2SE: designators end in _29; ports Diff_N=Q2_4_P_U_HF_CLK_Distribution Diff_P=Q2_4_N_U_HF_CLK_Distribution SingleEnded=HF_CLK8
U_HF_CLK_Distribution/U_Diff2SE: designators end in _30; ports Diff_N=Q2_5_N_U_HF_CLK_Distribution Diff_P=Q2_5_P_U_HF_CLK_Distribution SingleEnded=HF_CLK9
U_HF_CLK_Distribution/U_Diff2SE: designators end in _31; ports Diff_N=Q2_6_P_U_HF_CLK_Distribution Diff_P=Q2_6_N_U_HF_CLK_Distribution SingleEnded=HF_CLK10
U_HF_CLK_Distribution/U_Diff2SE: designators end in _32; ports Diff_N=Q2_7_N_U_HF_CLK_Distribution Diff_P=Q2_7_P_U_HF_CLK_Distribution SingleEnded=HF_CLK11
U_HF_CLK_Distribution/U_Diff2SE: designators end in _33; ports Diff_N=Q2_8_N_U_HF_CLK_Distribution Diff_P=Q2_8_P_U_HF_CLK_Distribution SingleEnded=HF_CLK12
U_HF_CLK_Distribution/U_Diff2SE: designators end in _34; ports Diff_N=Diff_N Diff_P=Diff_P SingleEnded=HF_CLK_IN
U_HF_CLK_Distribution/U_Diff2SE: designators end in _35; ports Diff_N=Q2_11_N_U_HF_CLK_Distribution Diff_P=Q2_11_P_U_HF_CLK_Distribution SingleEnded=HF_CLK_OUT

### Notes on the sheet
- Project/Equipment
- Document
- Designer
- Drawn by
- Check.by
- File
- Last Mod.
- Print Date
- Sheet
- Size
- A3
- of
- Rev
- (in symbol XFMR_MINI-CIRCUITS_TCM2-43X+) SEC; PRI

### Library data of the parts
C7 C12 C17 = CC0402_1NF_50V_10%_X7R: Non-polarised capacitor; Part Description: SMD Multilayer Chip Ceramic Capacitor; Manufacturer: GENERIC; Manufacturer1 Part Number: 223858715623; Voltage: 50V; TC: X7R; Tolerance: ±10%; Part Number: CC0402_1NF_50V_10%_X7R; Component Kind: Standard; Component Type: Standard; Pin Count: 2; Value: 1nF; Status: Not Recommended; Manufacturer Part Number: CC0402_1NF_50V_10%_X7R; Case: 0402; Mounted: Yes; Socket: No; SMD: Yes; Sense: No; Manufacturer1 Example: PHYCOMP; Manufacturer1 ComponentHeight: 0.55mm; HelpURL: \\cern.ch\dfs\Applications\Altium\Datasheets\CC0402_X7R_PHYCOMP.pdf; Author: CERN DEM JLC; CreateDate: 2007-12-03; LatestRevisionDate: 2007-12-03
C8 C13 = CMP-1034-00013-1: CAP 0.5pF 10V ±0.1pF 0402 (1005 Metric) Thickness 0.6mm SMD; Case-Metric: 1005; Tolerance: Â±0.1pF; Case-EIA: 0402; Value: 0.5pF; Max Thickness: 0.6 mm; Rated Voltage: 10 V; Technology: SMT
C9 C10 = CC0402_100PF_50V_5%_C0G: as C37 on sheet Reference_distribution; Part Number: CC0402_100PF_50V_5%_C0G; Component Kind: Standard; Component Type: Standard; Pin Count: 2; Value: 100pF; Status: Preferred; Manufacturer Part Number: CC0402_100PF_50V_5%_C0G; Case: 0402; Socket: No; SMD: Yes; Sense: No; Manufacturer1 Example: KEMET; Manufacturer1 ComponentHeight: 0.55mm; HelpURL: \\cern.ch\dfs\Applications\Altium\Datasheets\CC0805_C0G_KEMET_(Commercial Grade).pdf; Author: CERN DEM JLC; CreateDate: 2007-12-03; LatestRevisionDate: 2015-04-22
R1 = R0402_0R_JUMPER: as R31 on sheet PowerSupply; Part Number: R0402_0R_JUMPER; Component Kind: Standard; Component Type: Standard; Pin Count: 2; Value: 0; Status: Not recommended; Manufacturer Part Number: R0402_0R_JUMPER; Case: 0402; Mounted: Yes; Sense: No; Socket: No; SMD: Yes; Manufacturer1 Example: YAGEO PHYCOMP; Manufacturer1 ComponentHeight: 0.4mm; HelpURL: \\cern.ch\dfs\Applications\Altium\Datasheets\R0402_Phycomp_RC0402.pdf; Author: CERN DEM JLC; CreateDate: 2007-12-03; LatestRevisionDate: 2012-10-17
TR1 = XFMR_MINI-CIRCUITS_TCM2-43X+: 50 OHMS 10 to 4000 MHz RF Transformer; Power: 0.4W; Part Number: XFMR_MINI-CIRCUITS_TCM2-43X+; Component Kind: Standard; Component Type: Standard; Pin Count: 6; Value: TCM2-43X+; Status: None; Part Description: 50 Ohms 10 to 4000MHz RF Transformer; Manufacturer: MINI-CIRCUITS; Manufacturer Part Number: TCM2-43X+; Mounted: Yes; Socket: No; Sense: No; SMD: Yes; ComponentHeight: 4.06mm; HelpURL: \\cern.ch\dfs\Applications\Altium\Datasheets\XFMR_MINI-CIRCUITS_TCM2-43X+.pdf; Author: CERN DEM BC; CreateDate: 2016-02-12; LatestRevisionDate: 2016-02-12